# Altium schematic sheet BLOCO_ALIMENTAÇÃO.SchDoc
size A3; SheetNumber: 1; SheetTotal: 5
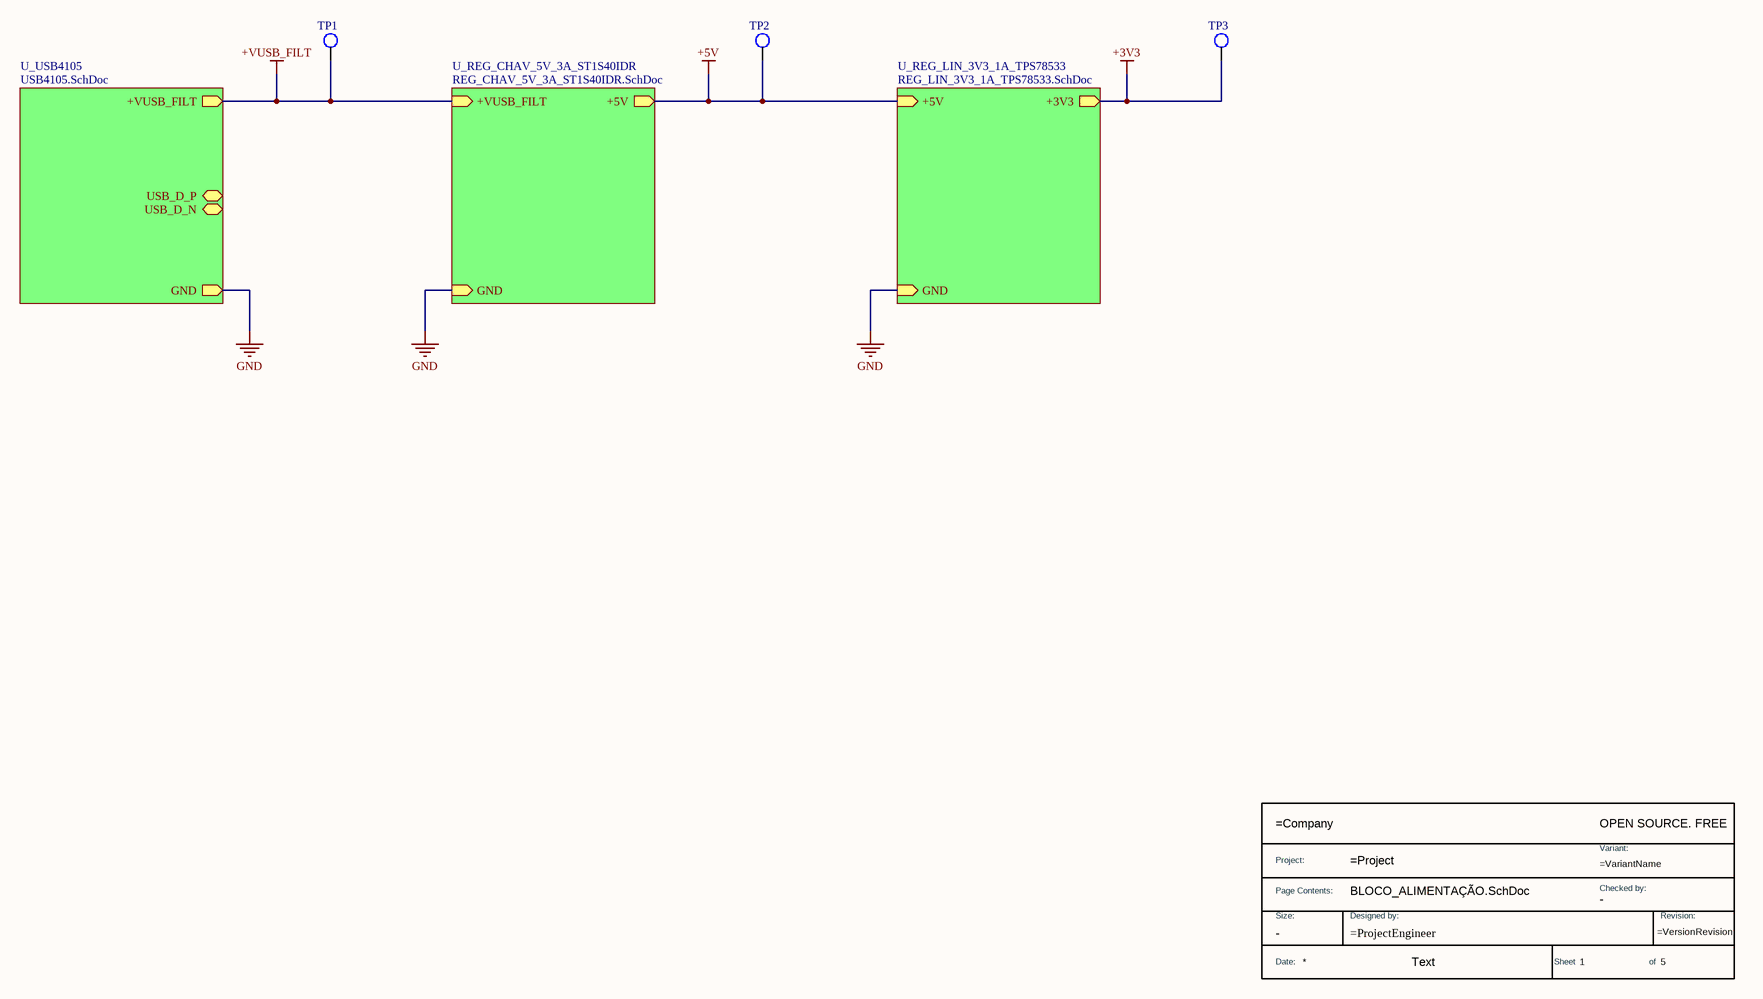
[diagram p0: BLOCO_ALIMENTAÇÃO.SchDoc]

## Parts
*  TitleBlock  (value not drawn)  (graphical)
TP1  TEST_POINT_1.5MM  [TESTPOINT_1.5MM]  (value not drawn)  (no BOM)
TP2  TEST_POINT_1.5MM  [TESTPOINT_1.5MM]  (value not drawn)  (no BOM)
TP3  TEST_POINT_1.5MM  [TESTPOINT_1.5MM]  (value not drawn)  (no BOM)

## Sub-sheets
U_REG_CHAV_5V_3A_ST1S40IDR = REG_CHAV_5V_3A_ST1S40IDR.SchDoc: +VUSB_FILT (in), +5V (out), GND (in)
U_REG_LIN_3V3_1A_TPS78533 = REG_LIN_3V3_1A_TPS78533.SchDoc: +5V (in), GND (in), +3V3 (out)
U_USB4105 = USB4105.SchDoc: USB_D_P (bidir), USB_D_N (bidir), +VUSB_FILT (out), GND (out)

## Nets
+3V3: TP3.1 ; sheet U_REG_LIN_3V3_1A_TPS78533/+3V3
+5V: TP2.1 ; sheet U_REG_CHAV_5V_3A_ST1S40IDR/+5V, sheet U_REG_LIN_3V3_1A_TPS78533/+5V
+VUSB_FILT: TP1.1 ; sheet U_USB4105/+VUSB_FILT, sheet U_REG_CHAV_5V_3A_ST1S40IDR/+VUSB_FILT
GND: sheet U_USB4105/GND, sheet U_REG_CHAV_5V_3A_ST1S40IDR/GND, sheet U_REG_LIN_3V3_1A_TPS78533/GND

## Notes on the sheet
- Todas as informações e detalhes técnicos deste documento são de inteira propriedade da empresa V2COM,
- não poderão ser copiados, reduzidos ou cedidos a terceiros sem prévia autorização por escrito da mesma.
- Salvo em (D/M/A):
- Página:
- de
- Nome do Projeto:
- https://v2com.com/
- Ed.:
- Responsável:
- Nome da página:
- Rev.:
- Projetista:
- Obs.:
- Revisor:
- Arquivo:
- -
- (in symbol TitleBlock) OPEN SOURCE. FREE; Project:; Variant:; Page Contents:; Checked by:; Size:; Designed by:; Revision:; Date:; Text; Sheet; of

## Library data of the parts
* = TitleBlock: Standard Title Block; DWG NO: =ProjectEngineer; Size: -; Checked by: -
TP1-TP3 = TEST_POINT_1.5MM: TEST_POINT; Manufacturer: V2COM; Origem: GT1021_ED02r2; Case/Package: SMD; Manufacturer Part Number: TEST_POINT; Observação: *; Valor: *